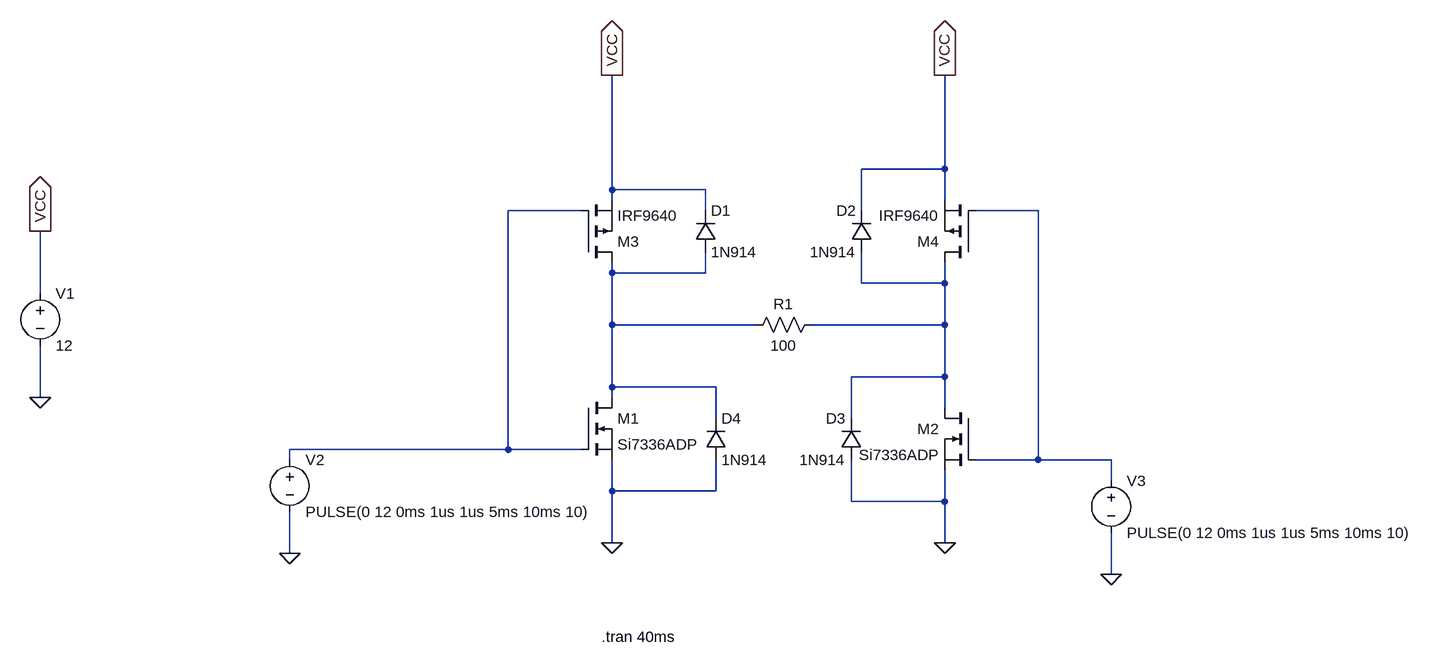
[diagram p0: schematic H-bridge_ex1.asc]
H-bridge_ex1.asc, the LTspice schematic file:
Version 4
SHEET 1 2152 704
WIRE 1408 -32 1408 -176
WIRE 1408 -32 1280 -32
WIRE 896 0 896 -176
WIRE 1040 0 896 0
WIRE 896 16 896 0
WIRE 1408 16 1408 -32
WIRE 848 32 736 32
WIRE 1040 32 1040 0
WIRE 1280 32 1280 -32
WIRE 1552 32 1456 32
WIRE 896 128 896 112
WIRE 1040 128 1040 96
WIRE 1040 128 896 128
WIRE 1280 144 1280 96
WIRE 1408 144 1408 112
WIRE 1408 144 1280 144
WIRE 16 160 16 64
WIRE 896 208 896 128
WIRE 1120 208 896 208
WIRE 1408 208 1408 144
WIRE 1408 208 1200 208
WIRE 1408 288 1408 208
WIRE 1408 288 1264 288
WIRE 896 304 896 208
WIRE 1056 304 896 304
WIRE 16 320 16 240
WIRE 896 320 896 304
WIRE 1408 336 1408 288
WIRE 1056 352 1056 304
WIRE 1264 352 1264 288
WIRE 736 400 736 32
WIRE 736 400 400 400
WIRE 848 400 736 400
WIRE 400 416 400 400
WIRE 1552 416 1552 32
WIRE 1552 416 1456 416
WIRE 1664 416 1552 416
WIRE 1664 448 1664 416
WIRE 896 464 896 416
WIRE 1056 464 1056 416
WIRE 1056 464 896 464
WIRE 1264 480 1264 416
WIRE 1408 480 1408 432
WIRE 1408 480 1264 480
WIRE 896 544 896 464
WIRE 1408 544 1408 480
WIRE 400 560 400 496
WIRE 1664 592 1664 528
FLAG 16 320 0
FLAG 16 64 VCC
IOPIN 16 64 Out
FLAG 400 560 0
FLAG 896 -176 VCC
IOPIN 896 -176 Out
FLAG 1408 -176 VCC
IOPIN 1408 -176 Out
FLAG 896 544 0
FLAG 1408 544 0
FLAG 1664 592 0
SYMBOL voltage 16 144 R0
WINDOW 123 0 0 Left 0
WINDOW 39 0 0 Left 0
SYMATTR InstName V1
SYMATTR Value 12
SYMBOL voltage 400 400 R0
WINDOW 123 0 0 Left 0
WINDOW 39 0 0 Left 0
SYMATTR InstName V2
SYMATTR Value PULSE(0 12 0ms 1us 1us 5ms 10ms 10)
SYMBOL nmos 848 320 R0
SYMATTR InstName M1
SYMATTR Value Si7336ADP
SYMBOL nmos 1456 336 M0
SYMATTR InstName M2
SYMATTR Value Si7336ADP
SYMBOL pmos 848 112 M180
SYMATTR InstName M3
SYMATTR Value IRF9640
SYMBOL pmos 1456 112 R180
SYMATTR InstName M4
SYMATTR Value IRF9640
SYMBOL diode 1024 96 M180
WINDOW 0 24 64 Left 2
WINDOW 3 24 0 Left 2
SYMATTR InstName D1
SYMATTR Value 1N914
SYMBOL diode 1296 96 R180
WINDOW 0 24 64 Left 2
WINDOW 3 24 0 Left 2
SYMATTR InstName D2
SYMATTR Value 1N914
SYMBOL diode 1280 416 R180
WINDOW 0 24 64 Left 2
WINDOW 3 24 0 Left 2
SYMATTR InstName D3
SYMATTR Value 1N914
SYMBOL diode 1040 416 M180
WINDOW 0 24 64 Left 2
WINDOW 3 24 0 Left 2
SYMATTR InstName D4
SYMATTR Value 1N914
SYMBOL voltage 1664 432 R0
WINDOW 123 0 0 Left 0
WINDOW 39 0 0 Left 0
SYMATTR InstName V3
SYMATTR Value PULSE(0 12 0ms 1us 1us 5ms 10ms 10)
SYMBOL res 1216 192 R90
WINDOW 0 0 56 VBottom 2
WINDOW 3 32 56 VTop 2
SYMATTR InstName R1
SYMATTR Value 100
TEXT 880 688 Left 2 !.tran 40ms

The netlist it stands for:
* H-bridge_ex1.asc
V1 VCC 0 12
V2 N001 0 PULSE(0 12 0ms 1us 1us 5ms 10ms 10)
M1 N003 N001 0 0 Si7336ADP
M2 N004 N002 0 0 Si7336ADP
M3 N003 N001 VCC VCC IRF9640
M4 N004 N002 VCC VCC IRF9640
D1 N003 VCC 1N914
D2 N004 VCC 1N914
D3 0 N004 1N914
D4 0 N003 1N914
V3 N002 0 PULSE(0 12 0ms 1us 1us 5ms 10ms 10)
R1 N004 N003 100
.model D D
.lib standard.dio
.model NMOS NMOS
.model PMOS PMOS
.lib standard.mos
.tran 40ms
.backanno
.end